# Altium project STM32_PCB.PrjPcb
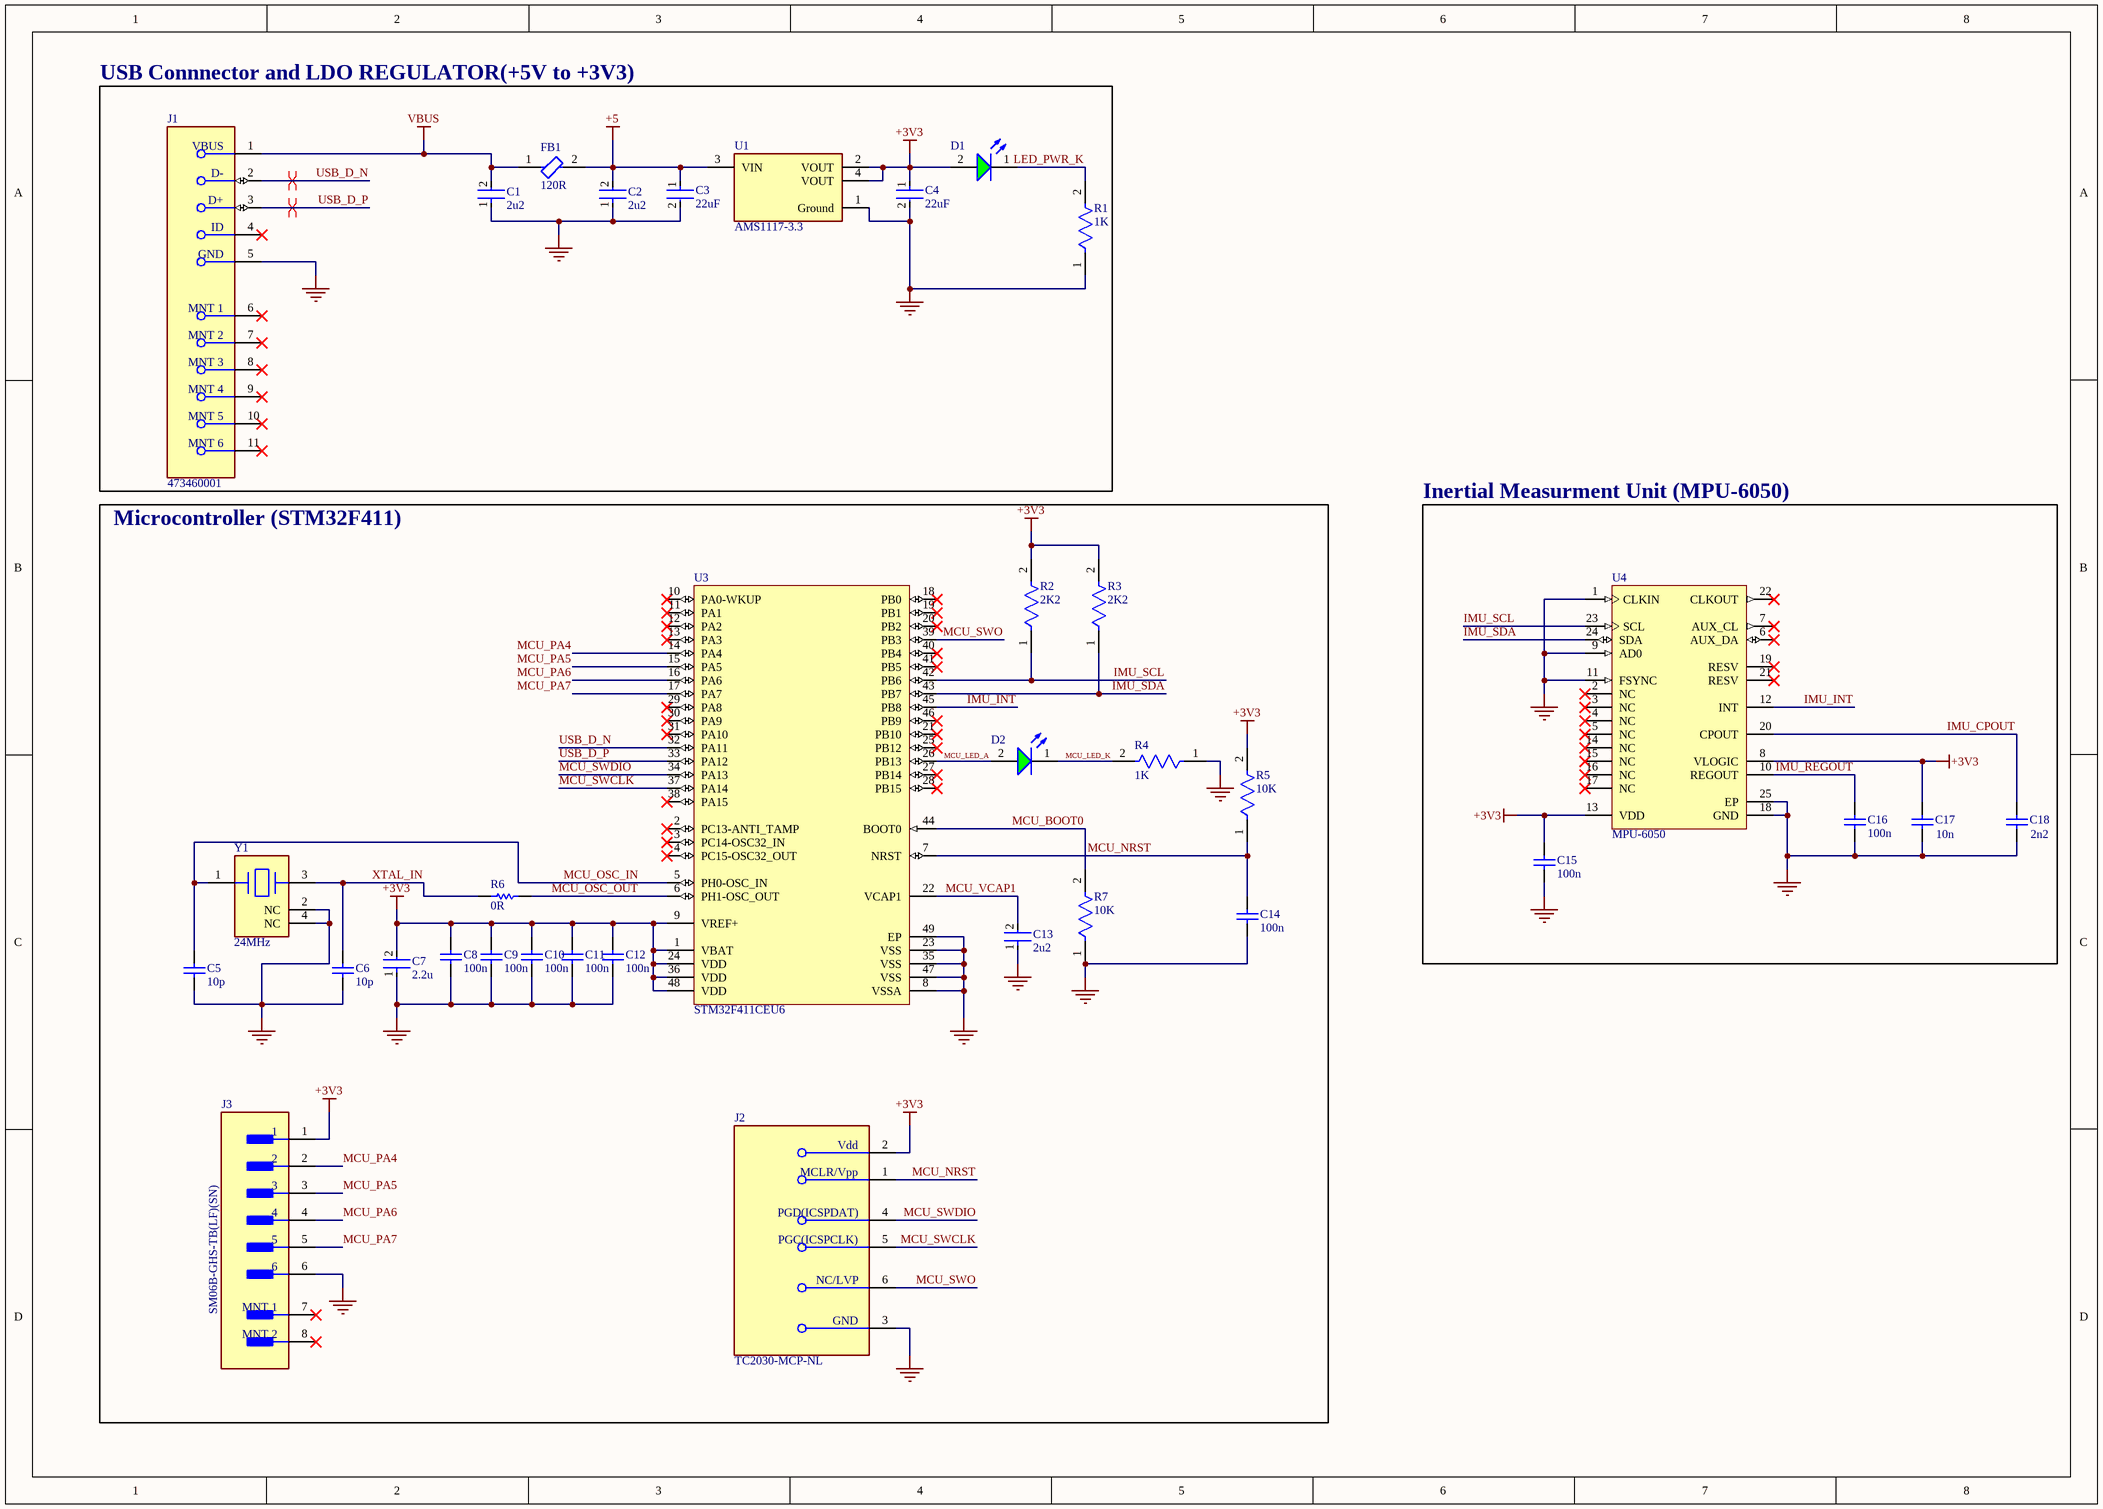
[diagram p0: STM32_Schematics.SchDoc]
1 sheet, 35 parts. Net scope: global (net labels, ports and power ports of the same name join across sheets).
Board file: STM32_PCB.PcbDoc

## Sheet STM32_Schematics.SchDoc
size A3; SheetNumber: 1; SheetTotal: 1

### Parts
C1  2u2  [FP-GRM188-0_2-IPC_B]
C2  2u2  [FP-GRM188-0_2-IPC_B]
C3  22uF  [FP-GRM219-0_2-0_15-IPC_B]
C4  22uF  [FP-GRM219-0_2-0_15-IPC_B]
C5  10p  [CAPC1005X55X25NL05T05]
C6  10p  [CAPC1005X55X25NL05T05]
C7  2.2u  [FP-GRM188-0_2-IPC_B]
C8  100n  [CAPC1050X55X23ML05T13]
C9  100n  [CAPC1050X55X23ML05T13]
C10  100n  [CAPC1050X55X23ML05T13]
C11  100n  [CAPC1050X55X23ML05T13]
C12  100n  [CAPC1050X55X23ML05T13]
C13  2u2  [FP-GRM188-0_2-IPC_B]
C14  100n  [CAPC1050X55X23ML05T13]
C15  100n  [CAPC1050X55X23ML05T13]
C16  100n  [CAPC1050X55X23ML05T13]
C17  10n  [CAPC1005X55X25LL05T10]
C18  2n2  [CAPC1005X55X25LL05T10]
D1  150040VS73240  [WL-SMCC_0402_L1W0.5H0.4]  (value not drawn)
D2  150040VS73240  [WL-SMCC_0402_L1W0.5H0.4]  (value not drawn)
FB1  120R  [FP-BLM18-0_15-t0_8-IPC_B]
J1  473460001  [FP-473460001-MFG]
J2  TC2030-MCP-NL  [FP-TC2030-MCP-NL-MFG]
J3  SM06B-GHS-TB(LF)(SN)  [FP-SM06B-GHS-TB_LF_SN-MFG]
R1  1K  [FP-RC0402-0_4-IPC_A]
R2  2K2  [FP-AC0402-IPC_C]
R3  2K2  [FP-AC0402-IPC_C]
R4  1K  [FP-RC0402-0_4-IPC_A]
R5  10K  [FP-CRCW0402-C-e3-IPC_C]
R6  0R  [RESC1005X40X25LL05T10]
R7  10K  [FP-CRCW0402-C-e3-IPC_C]
U1  AMS1117-3.3  [FP-AMS1117-IPC_C]
U3  STM32F411CEU6  [STM-UFQFPN48_L]
U4  MPU-6050  [IS-QFN-24_V]
Y1  24MHz  [FP-XRCGB_F_N-MFG]

### Blocks framed on the sheet
USB Connnector and LDO REGULATOR(+5V to +3V3): C1-C4 D1 FB1 J1 R1 U1
Microcontroller (STM32F411): C5-C14 D2 J2 J3 R2-R7 U3 Y1
Inertial Measurment Unit (MPU-6050): C15-C18 U4

### Nets
+3V3: C4.1 C7.2 C8.2 C9.2 C10.2 C11.2 C12.2 C15.2 C17.2 D1.2(A) J2.2(Vdd) J3.1 R2.2 R3.2 R5.2 U1.2(VOUT) U1.4(VOUT) U3.1(VBAT) U3.9(VREF+) U3.24(VDD) U3.36(VDD) U3.48(VDD) U4.8(VLOGIC) U4.13(VDD)
+5: C2.2 C3.1 FB1.2 U1.3(VIN)
GND: C1.1 C2.1 C3.2 C4.2 C5.1 C6.1 C7.1 C8.1 C9.1 C10.1 C11.1 C12.1 C13.1 C14.1 C15.1 C16.2 C17.1 C18.1 J1.5(GND) J2.3(GND) J3.6 R1.1 R4.1 R7.1 U1.1(Ground) U3.8(VSSA) U3.23(VSS) U3.35(VSS) U3.47(VSS) U3.49(EP) U4.1(CLKIN) U4.9(AD0) U4.11(FSYNC) U4.18(GND) U4.25(EP) Y1.2(NC) Y1.4(NC)
VBUS: C1.2 FB1.1 J1.1(VBUS)
IMU_CPOUT: C18.2 U4.20(CPOUT)
IMU_INT: U3.45(PB8) U4.12(INT)
IMU_REGOUT: C16.1 U4.10(REGOUT)
IMU_SCL: R2.1 U3.42(PB6) U4.23(SCL)
IMU_SDA: R3.1 U3.43(PB7) U4.24(SDA)
LED_PWR_K: D1.1(K) R1.2
MCU_BOOT0: R7.2 U3.44(BOOT0)
MCU_LED_A: D2.2(A) U3.26(PB13)
MCU_LED_K: D2.1(K) R4.2
MCU_NRST: C14.2 J2.1(MCLR/Vpp) R5.1 U3.7(NRST)
MCU_OSC_IN: C5.2 U3.5(PH0-OSC_IN) Y1.1(1_Input/Output)
MCU_OSC_OUT: R6.2 U3.6(PH1-OSC_OUT)
MCU_PA4: J3.2 U3.14(PA4)
MCU_PA5: J3.3 U3.15(PA5)
MCU_PA6: J3.4 U3.16(PA6)
MCU_PA7: J3.5 U3.17(PA7)
MCU_SWCLK: J2.5(PGC(ICSPCLK)) U3.37(PA14)
MCU_SWDIO: J2.4(PGD(ICSPDAT)) U3.34(PA13)
MCU_SWO: J2.6(NC/LVP) U3.39(PB3)
MCU_VCAP1: C13.2 U3.22(VCAP1)
USB_D_N: J1.2(D-) U3.32(PA11)
USB_D_P: J1.3(D+) U3.33(PA12)
XTAL_IN: C6.2 R6.1 Y1.3(2_Input/Output)

Not connected (* = marked no-connect by the designer): J1 4(ID)* 6(MNT_1)* 7(MNT_2)* 8(MNT_3)* 9(MNT_4)* 10(MNT_5)* 11(MNT_6)*; J3 7(MNT_1)* 8(MNT_2)*; U3 2(PC13-ANTI_TAMP)* 3(PC14-OSC32_IN)* 4(PC15-OSC32_OUT)* 10(PA0-WKUP)* 11(PA1)* 12(PA2)* 13(PA3)* 18(PB0)* 19(PB1)* 20(PB2)* 21(PB10)* 25(PB12)* 27(PB14)* 28(PB15)* 29(PA8)* 30(PA9)* 31(PA10)* 38(PA15)* 40(PB4)* 41(PB5)* 46(PB9)*; U4 2(NC)* 3(NC)* 4(NC)* 5(NC)* 6(AUX_DA)* 7(AUX_CL)* 14(NC)* 15(NC)* 16(NC)* 17(NC)* 19(RESV)* 21(RESV)* 22(CLKOUT)*

### Layout directives
differential pair; net class DIFF_USB: USB_D_N, USB_D_P

### Library data of the parts
C1 C2 C7 C13 = CMP-06035-000124-3: CAP CER 2.2UF 16V X7S 0603; Tolerance: 10%; Mount: Surface Mount; Width: 0.031inch; Voltage Rating (DC): 16V; Max Operating Temperature: 125°C; Termination: SMD/SMT; Resistor Type: Ceramic; Voltage Rating: 16V; Height: 0.8mm; Packaging: Tape and Reel; Package Quantity: 4000; Case Code (Metric): 1608; Thickness: 0.039inch; Case/Package: 0603; Depth: 0.8mm; Min Operating Temperature: -55°C; Length: 1.6mm; Case Code (Imperial): 0603; Dielectric: X7S; Capacitance: 2.2uF; Weight: 0.000222oz
C3 C4 = CMP-06035-014527-1: Chip Multilayer Ceramic Capacitors for General Purpose, 0805, 22uF, X5R, 15%, 20%, 16V; Thickness: 850um; Tolerance: 20%; Dielectric: X5R; Capacitance: 22uF; Length: 2mm; Width: 1.25mm; Voltage Rating (DC): 16V
C5 C6 = CMP-2008-01705-1: Part Number: VJ0402A100FXQCW1BC; Manufacturer: Vitramon
C8-C12 C14-C16 = CMP-2000-05439-1: Chip Capacitor, 100 nF, +/- 10%, 16 V, -55 to 125 degC, 0402 (1005 Metric), RoHS, Tape and Reel; Manufacturer: Samsung Electro-Mechanics; Capacitance: 100000pF; Dielectric: X7R; Rated Voltage: 16V; Case Size/Dimension: 0402; Tolerance (%): ±10%; Manufacturer URL: http://www.samsungsem.com/global/index.jsp; Datasheet URL: https://datasheet.ciiva.com/29198/458718-da-01-en-vs-kondensator-0402-29198423.pdf; Datasheet Version: Nov-10; ComponentLink1Description: New link; ComponentLink1URL: *
C17 = CMP-2000-06332-1: Chip Capacitor, 10 nF, 16 V, 10%, -55 to 125 degC, 0402 (1005 Metric), RoHS, Tape and Reel; Manufacturer: Murata; Rated Voltage: 16V; Capacitance: 10000pF; Dielectric: X7R; Manufacturer URL: http://www.murata.com/; Package Description: 2-Pin Surface Mount Device, Body 1 x 0.5 mm; Case Size/Dimension: 0402; Tolerance (%): ±10%; Datasheet Version: 06/2016; Package Reference: 0402; Mounting Technology: SurfaceMount; Datasheet URL: http://psearch.en.murata.com/capacitor/product/GRM155R71C103KA01%23.pdf
C18 = CMP-2000-06332-1: Chip Capacitor, 2.2nF, 16 V, 10%, -55 to 125 degC, 0402 (1005 Metric), RoHS, Tape and Reel; Manufacturer: Murata; Rated Voltage: 16V; Dielectric: X7R; Capacitance: 2.2nF; Manufacturer URL: http://www.murata.com/; Package Description: 2-Pin Surface Mount Device, Body 1 x 0.5 mm; Case Size/Dimension: 0402; Tolerance (%): ±10%; Datasheet Version: 06/2016; Package Reference: 0402; Mounting Technology: SurfaceMount; Datasheet URL: http://psearch.en.murata.com/capacitor/product/GRM155R71C103KA01%23.pdf
D1 D2 = CMP-03913-90235559-3: Wurth Elektronik LED, WL-SMCC, 1005 (0402), 570 nm, 1 x 0.5 x 0.4mm; Manufacturer Lifecycle Status: ACTIVE; Luminous Intensity: 50mcd; Wavelength: 570nm; Power Dissipation: 75mW; YEOL: 1 = Estimated lifetime > 10 years; Reverse Voltage: 5V; Color: Green; Forward Current: 60mA; Peak Wavelength: 572nm; Max Junction Temperature (Tj): 95°C; Viewing Angle: 120°; Forward Voltage: 2V; Min Operating Temperature: -40°C; Height: 400µm; Max Operating Temperature: 85°C; Width: 500µm; Dominant Wavelength: 570nm; Packaging: Tape and Reel; Max Reverse Voltage (DC): 5V; RoHS: Compliant; Case/Package: 0402; Lifecycle Status: Production; Length: 1mm
FB1 = CMP-0686-00439-3: Chip Ferrite Bead, 0603, 120Ω @ 100MHz, 0.18Ω, 25%, 800mA; DC Resistance (DCR): 180mR; Number of Lines: 1; Current Rating: 500mA; Material: Steel; Shielding: Unshielded; Case/Package: 0603; Max Operating Temperature: 125°C; Min Operating Temperature: -55°C; Series: BLM18A; Case Code (Metric): 1608; DC Resistance-Max: 180mR; Package Quantity: 1; Core Material: Ferrite; Radiation Hardening: No; Impedance: 120R; Length: 1.6mm; Lead Free: Lead Free; Max DC Current: 500mA; Termination: SMD/SMT; Number of Pins: 2; Tolerance: 25%; Military Standard: Not; REACH SVHC: No SVHC; Number of Circuits: 1; Test Frequency: 100MHz; Max Current Rating: 500mA; Depth: 0.8mm; Frequency: 100MHz; Width: 0.8mm; Case Code (Imperial): 0603; DC Current: 500mA; Height: 0.8mm; RoHS Compliant: Yes; Packaging: Tape and Reel
J1 = CMP-2000-05246-2: CONN RCPT USB2.0 MICRO B SMD R/A; Manufacturer: Molex; Conn Orientation: Right Angle; Is Female: yes; Shielding: true; Pitch: 0.65mm; Number Of Contacts: 5; Voltage Rating: 30V; Current Rating: 1.8A; Device Class L2: USB Connectors; Digikey Description: CONN RCPT USB2.0 MICRO B SMD R/A; Height: 2.945mm; RoHS: TRUE; ComponentLink2Description: Datasheet; Octopart: https://octopart.com/47346-0001-molex-7164928; Automotive: No; Package: 0; Category: Conn; Device Class L1: Connectors; Usb Standard: USB 2.0; Temperature: -30°C to +85°C; Temperature Range Low: -30°C; Footprint Url: https://www.molex.com/pdm_docs/sd/473460001_sd.pdf; ComponentLink2URL: https://www.molex.com/webdocs/datasheets/pdf/en-us/0473460001_IO_CONNECTORS.pdf; Lead Free: Yes; Manufacturer Part Number: 473460001; Contact Material: Gold,Nickel; Temperature Range High: +85°C; Device Class L3: unset
J2 = CMP-205963-000002-1: CABLE TAG-CONNECT IN-CIRCUIT; RoHS Compliant: Yes; Series: -; Reach SVHC Compliant: Yes; Package Quantity: 1; Lead Free: Lead Free
J3 = CMP-17439-000061-1: CONN HEADER SMD R/A 6POS 1.25MM; Number of Contacts: 6; Voltage Rating: 50V; Current Rating: 1A; Connector Type: Outer Shroud Contact; Contact Resistance: 50mR; Orientation: Right Angle; Max Operating Temperature: 85°C; Mount: Surface Mount; Packaging: Tape and Reel; Contact Plating: Tin; Depth: 4.05mm; Max Voltage Rating (AC): 50V; Lead Free: Lead Free; Pitch: 1.25mm; Number of Positions: 6; Max Current Rating: 1A; Termination: Solder; Min Operating Temperature: -25°C; Housing Color: Beige; Fastening Type: Ramp; Length: 10.75mm; Color: Natural; Contact Material: Bronze; Housing Material: Polyamide; Number of Rows: 1
R1 R4 = CMP-2002-07472-3: RES 1K OHM 1% 1/16W 0402; Max Power Dissipation: 63mW; Resistance: 1kR; Voltage Rating (DC): 50V; Temperature Coefficient: 100ppm/°C; Power Rating: 62.5mW; Technology: THICK FILM; Size Code: 0402; Series: RC; Length: 1mm; Case/Package: 0402; Features: Moisture Resistant; Termination: SMD/SMT; Case Code (Metric): 1005; Reach SVHC Compliant: Yes; Number of Terminations: 2; Tolerance: 1%; Lead Free: Lead Free; Military Standard: Not; Resistor Type: Thick Film; Max Operating Temperature: 155°C; RoHS Compliant: Yes; Construction: Rectangular; Voltage Rating: 50V; Packaging: Tape and Reel; Height: 0.32mm; Number of Pins: 2; Resistance Tolerance: 1%; Case Code (Imperial): 0402; Depth: 0.5mm; Min Operating Temperature: -55°C; Width: 0.5mm
R2 R3 = CMP-03412-048432-1: RES 2.2kΩ ±1% 0.125W 0402
R5 R7 = CMP-02407-012085-1: RES 10K OHM 1% 1/16W 0402; Temperature Coefficient: 100ppm/°C; Power Rating: 62.5mW; Resistance: 10kR; Lead Free: Lead Free; Max Operating Temperature: 155°C; RoHS Compliant: Yes; Mount: Surface Mount; Min Operating Temperature: -55°C; Termination: Wraparound; Length: 1mm; Resistor Type: Thick Film; Contact Plating: Tin; Tolerance: 1%; Case/Package: Molded
R6 = CMP-2000-06964-1: Chip Resistor, 0 Ohm, +/- 5%, -55 to 125 degC, 0402 (1005 Metric), RoHS, Tape and Reel; Manufacturer: Samsung Electro-Mechanics; Resistance: 0O; Temp Coefficient: ±200ppm/°C; Rated Power: 0.063W; Manufacturer URL: http://www.samsungsem.com/global/index.jsp; Tolerance (%): ±5%; Package Reference: 0402; Mounting Technology: SurfaceMount; Datasheet Version: 11/2010; Size Code: 0402; Package Description: 2-Pin Surface Mount Device, Body 1 x 0.5 mm; Datasheet URL: https://datasheet.ciiva.com/15196/getdatasheetpartid-499011-15196236.pdf
U1 = CMP-209535-000001-1: LDO Voltage Regulators 1A, 3.3V; Manufacturer: Advanced Monolithic Systems; Dropout Voltage: 1.1V; Output Type: Fixed; Nominal Supply Current: 5mA; Max Power Dissipation: 1.2W; Max Supply Voltage: 15V; Number Of Outputs: 1; Standoff Height: 0.64mm; Max Junction Temp: +125°C; Height: 1.8mm; Package: AMS1117; Device Class L2: Power Management ICs; ComponentLink2Description: Datasheet; ComponentLink2URL: http://www.advanced-monolithic.com/pdf/ds1117.pdf; Category: IC; RoHS: TRUE; Automotive: No; Device Class L1: Integrated Circuits (ICs); Output Current: 1A; Device Class L3: Voltage Regulators - Linear; Temperature: -40°C to +125°C; Output Voltage: 3.3V; Manufacturer Part Number: AMS1117-3.3; Temperature Range Low: -40°C; Octopart: https://octopart.com/ams1117-3.3-advanced+monolithic+systems-25899300; Lead Free: Yes; Ipc Land Pattern Name: SOT229P700X180-4; Temperature Range High: +125°C
U3 = CMP-0243-00165-1: ARM Cortex-M4 32-bit MCU+FPU, 512 KB Flash, 128 KB RAM, 36 I/Os, 48-Pin UFQFPN, -40 to 85 degC, Tray; Operating Frequency(F) (Processor speed) (MHz): 100; FLASH Size (Prog) (kB): 512; Internal RAM Size (kB): 128; I/Os (High Current): 36; Supply Voltage(Vcc) min (V): 1.7; Package Reference: 48-Pin Ultra Thin Fine Pitch Quad Flat No-Lead, 7 x 7 x 0.6 mm Body, 0.5 mm Pitch, Exposed Pad; ComponentLink1Description: Manufacturer URL; ComponentLink1URL: http://www.st.com/; Packing: Tray; Package Description: UFQFPN48; Core: ARM Cortex-M4; ComponentLink2Description: Datasheet; ComponentLink2URL: http://www.st.com/st-web-ui/static/active/en/resource/technical/document/datasheet/DM00115249.pdf; DatasheetVersion: Rev. 6; Mounting Technology: Surface Mount
U4 = CMP-1753-00002-2: 3-Axis Gyroscope, Accelerometer and a Digital Motion Processor(TM) (DMP), 2.375 to 3.46 V, -40 to 85 degC, 24-Pin QFN, RoHS, Tape and Reel; Manufacturer: InvenSense; Featured Product: MPU-60506-Axis,IntegratedI²CSolution; Other Names: 1428-1007-2 / MPU6050; Sensor Type: MotionTracking; Online Catalog: MPU-6000™Series; Unit PriceUSD: Digital; Datasheet Version: Rev. 3.3, 05/2012; Category: Sensors,Transducers; Datasheet URL: http://datasheet.octopart.com/MPU-6050-InvenSense-datasheet-14421344.pdf; Family: Multifunction; Standard Package: 5,000; Manufacturer URL: http://www.invensense.com/; Output Type: Digital; Dynamic Catalog: MPU-6000™Series
Y1 = CMP-06054-000017-1: CRYSTAL 24.0000MHZ 6PF SMD; ESR (Equivalent Series Resistance): 150R; Tolerance: 30ppm; Frequency Stability: 40ppm; Length: 2mm; Height: 0.028inch; Lead Free: Lead Free; Min Operating Temperature: -30°C; REACH SVHC: No SVHC; RoHS Compliant: Yes; Operating Frequency: 24 MHz; Series Resistance: 150R; Mount: Surface Mount; Frequency: 24MHz; Packaging: Tape and Reel; Termination: SMD/SMT; Case/Package: SMD/SMT; Max Operating Temperature: 85°C; Width: 1.6mm; Number of Pins: 4; Load Capacitance: 6pF; Package Quantity: 1; Depth: 1.6mm; Frequency Tolerance: 30ppm; Series: XRCGB